# Altium project PCB_Project_bjt.PrjPcb
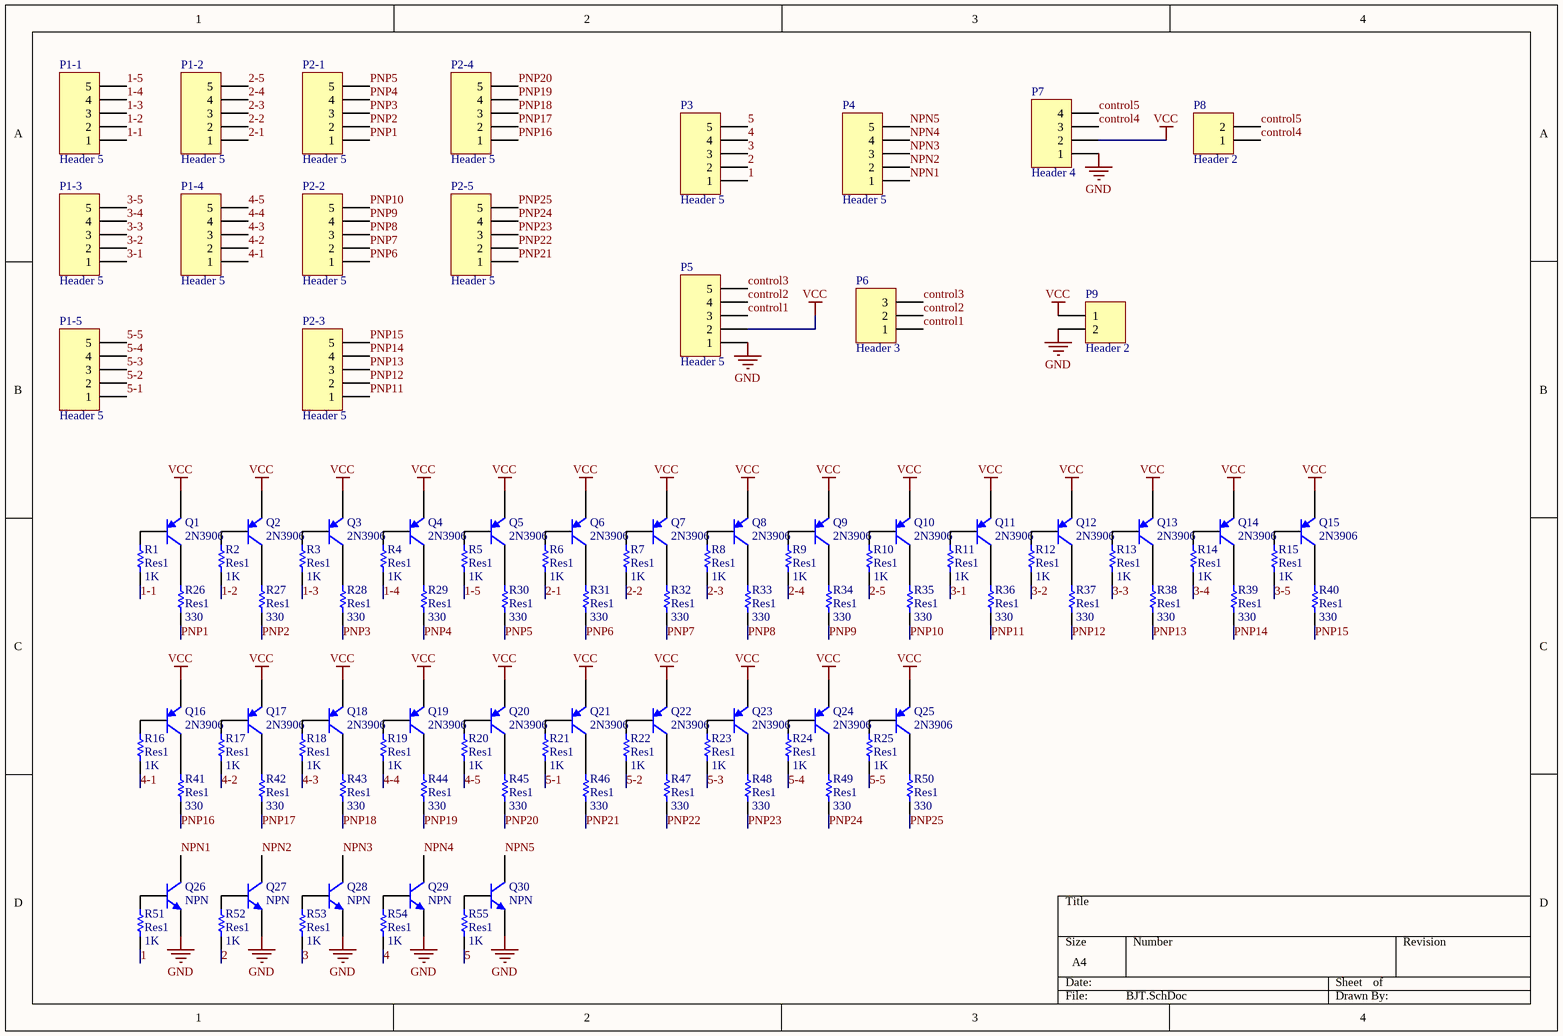
[diagram p0: BJT.SchDoc]
1 sheet, 102 parts. Net scope: global (net labels, ports and power ports of the same name join across sheets).
Board file: PCB1.PcbDoc

## Sheet BJT.SchDoc
size A4; SheetNumber: 1; SheetTotal: 1; SPICEModelCacheCIMVWHFW: <root> / <DocumentId>CIMVWHFW</DocumentId> / <CacheFrame Number="0"> / <Model Name="2n3906" Kind="MDL"> / <Text>*2N3906 / *Si 310mW  40V 200mA 250MHz pkg:TO-92B 1,2,3 / .MODEL 2N3906 PNP(IS=4E-14 BF=400 VAF=50 IKF=0.02 ISE=7E-15 NE=1.16 / + BR=7.5 RC=2.4 CJE=6.3E-12 VJE=0.75 TF=5E-10 CJC=5.8E-12 VJC=0.75 TR=2.3E-8 / + VJS=0.75 XTB=1.5 KF=6E-16 )</Text> / </Model> / <Model Name="npn" Kind="MDL"> / <Text>*Default NPN BJT / *NPN Trans Pinout: C,B,E / .MODEL NPN NPN()</Text> / </Model> / </CacheFrame> / </root>

### Parts
P1-1  Header 5  [HDR1X5]
P1-2  Header 5  [HDR1X5]
P1-3  Header 5  [HDR1X5]
P1-4  Header 5  [HDR1X5]
P1-5  Header 5  [HDR1X5]
P2-1  Header 5  [HDR1X5]
P2-2  Header 5  [HDR1X5]
P2-3  Header 5  [HDR1X5]
P2-4  Header 5  [HDR1X5]
P2-5  Header 5  [HDR1X5]
P3  Header 5  [HDR1X5]
P4  Header 5  [HDR1X5]
P5  Header 5  [HDR1X5]
P6  Header 3  [HDR1X3]
P7  Header 4  [HDR1X4]
P8  Header 2  [HDR1X2]
P9  Header 2  [HDR1X2]
Q1  2N3906  [BJT]
Q2  2N3906  [BJT]
Q3  2N3906  [BJT]
Q4  2N3906  [BJT]
Q5  2N3906  [BJT]
Q6  2N3906  [BJT]
Q7  2N3906  [BJT]
Q8  2N3906  [BJT]
Q9  2N3906  [BJT]
Q10  2N3906  [BJT]
Q11  2N3906  [BJT]
Q12  2N3906  [BJT]
Q13  2N3906  [BJT]
Q14  2N3906  [BJT]
Q15  2N3906  [BJT]
Q16  2N3906  [BJT]
Q17  2N3906  [BJT]
Q18  2N3906  [BJT]
Q19  2N3906  [BJT]
Q20  2N3906  [BJT]
Q21  2N3906  [BJT]
Q22  2N3906  [BJT]
Q23  2N3906  [BJT]
Q24  2N3906  [BJT]
Q25  2N3906  [BJT]
Q26  NPN  [BJT]
Q27  NPN  [BJT]
Q28  NPN  [BJT]
Q29  NPN  [BJT]
Q30  NPN  [BJT]
R1  Res1  value 1K  [AXIAL-0.3]
R2  Res1  value 1K  [AXIAL-0.3]
R3  Res1  value 1K  [AXIAL-0.3]
R4  Res1  value 1K  [AXIAL-0.3]
R5  Res1  value 1K  [AXIAL-0.3]
R6  Res1  value 1K  [AXIAL-0.3]
R7  Res1  value 1K  [AXIAL-0.3]
R8  Res1  value 1K  [AXIAL-0.3]
R9  Res1  value 1K  [AXIAL-0.3]
R10  Res1  value 1K  [AXIAL-0.3]
R11  Res1  value 1K  [AXIAL-0.3]
R12  Res1  value 1K  [AXIAL-0.3]
R13  Res1  value 1K  [AXIAL-0.3]
R14  Res1  value 1K  [AXIAL-0.3]
R15  Res1  value 1K  [AXIAL-0.3]
R16  Res1  value 1K  [AXIAL-0.3]
R17  Res1  value 1K  [AXIAL-0.3]
R18  Res1  value 1K  [AXIAL-0.3]
R19  Res1  value 1K  [AXIAL-0.3]
R20  Res1  value 1K  [AXIAL-0.3]
R21  Res1  value 1K  [AXIAL-0.3]
R22  Res1  value 1K  [AXIAL-0.3]
R23  Res1  value 1K  [AXIAL-0.3]
R24  Res1  value 1K  [AXIAL-0.3]
R25  Res1  value 1K  [AXIAL-0.3]
R26  Res1  value 330  [AXIAL-0.3]
R27  Res1  value 330  [AXIAL-0.3]
R28  Res1  value 330  [AXIAL-0.3]
R29  Res1  value 330  [AXIAL-0.3]
R30  Res1  value 330  [AXIAL-0.3]
R31  Res1  value 330  [AXIAL-0.3]
R32  Res1  value 330  [AXIAL-0.3]
R33  Res1  value 330  [AXIAL-0.3]
R34  Res1  value 330  [AXIAL-0.3]
R35  Res1  value 330  [AXIAL-0.3]
R36  Res1  value 330  [AXIAL-0.3]
R37  Res1  value 330  [AXIAL-0.3]
R38  Res1  value 330  [AXIAL-0.3]
R39  Res1  value 330  [AXIAL-0.3]
R40  Res1  value 330  [AXIAL-0.3]
R41  Res1  value 330  [AXIAL-0.3]
R42  Res1  value 330  [AXIAL-0.3]
R43  Res1  value 330  [AXIAL-0.3]
R44  Res1  value 330  [AXIAL-0.3]
R45  Res1  value 330  [AXIAL-0.3]
R46  Res1  value 330  [AXIAL-0.3]
R47  Res1  value 330  [AXIAL-0.3]
R48  Res1  value 330  [AXIAL-0.3]
R49  Res1  value 330  [AXIAL-0.3]
R50  Res1  value 330  [AXIAL-0.3]
R51  Res1  value 1K  [AXIAL-0.3]
R52  Res1  value 1K  [AXIAL-0.3]
R53  Res1  value 1K  [AXIAL-0.3]
R54  Res1  value 1K  [AXIAL-0.3]
R55  Res1  value 1K  [AXIAL-0.3]

### Nets
GND: P5.1 P7.1 P9.2 Q26.3(E) Q27.3(E) Q28.3(E) Q29.3(E) Q30.3(E)
VCC: P5.2 P7.2 P9.1 Q1.1(E) Q2.1(E) Q3.1(E) Q4.1(E) Q5.1(E) Q6.1(E) Q7.1(E) Q8.1(E) Q9.1(E) Q10.1(E) Q11.1(E) Q12.1(E) Q13.1(E) Q14.1(E) Q15.1(E) Q16.1(E) Q17.1(E) Q18.1(E) Q19.1(E) Q20.1(E) Q21.1(E) Q22.1(E) Q23.1(E) Q24.1(E) Q25.1(E)
1: P3.1 R51.1
1-1: P1-1.1 R1.1
1-2: P1-1.2 R2.1
1-3: P1-1.3 R3.1
1-4: P1-1.4 R4.1
1-5: P1-1.5 R5.1
2: P3.2 R52.1
2-1: P1-2.1 R6.1
2-2: P1-2.2 R7.1
2-3: P1-2.3 R8.1
2-4: P1-2.4 R9.1
2-5: P1-2.5 R10.1
3: P3.3 R53.1
3-1: P1-3.1 R11.1
3-2: P1-3.2 R12.1
3-3: P1-3.3 R13.1
3-4: P1-3.4 R14.1
3-5: P1-3.5 R15.1
4: P3.4 R54.1
4-1: P1-4.1 R16.1
4-2: P1-4.2 R17.1
4-3: P1-4.3 R18.1
4-4: P1-4.4 R19.1
4-5: P1-4.5 R20.1
5: P3.5 R55.1
5-1: P1-5.1 R21.1
5-2: P1-5.2 R22.1
5-3: P1-5.3 R23.1
5-4: P1-5.4 R24.1
5-5: P1-5.5 R25.1
control1: P5.3 P6.1
control2: P5.4 P6.2
control3: P5.5 P6.3
control4: P7.3 P8.1
control5: P7.4 P8.2
NPN1: P4.1 Q26.1(C)
NPN2: P4.2 Q27.1(C)
NPN3: P4.3 Q28.1(C)
NPN4: P4.4 Q29.1(C)
NPN5: P4.5 Q30.1(C)
PNP1: P2-1.1 R26.1
PNP2: P2-1.2 R27.1
PNP3: P2-1.3 R28.1
PNP4: P2-1.4 R29.1
PNP5: P2-1.5 R30.1
PNP6: P2-2.1 R31.1
PNP7: P2-2.2 R32.1
PNP8: P2-2.3 R33.1
PNP9: P2-2.4 R34.1
PNP10: P2-2.5 R35.1
PNP11: P2-3.1 R36.1
PNP12: P2-3.2 R37.1
PNP13: P2-3.3 R38.1
PNP14: P2-3.4 R39.1
PNP15: P2-3.5 R40.1
PNP16: P2-4.1 R41.1
PNP17: P2-4.2 R42.1
PNP18: P2-4.3 R43.1
PNP19: P2-4.4 R44.1
PNP20: P2-4.5 R45.1
PNP21: P2-5.1 R46.1
PNP22: P2-5.2 R47.1
PNP23: P2-5.3 R48.1
PNP24: P2-5.4 R49.1
PNP25: P2-5.5 R50.1
NetQ1_2: Q1.2(B) R1.2
NetQ1_3: Q1.3(C) R26.2
NetQ2_2: Q2.2(B) R2.2
NetQ2_3: Q2.3(C) R27.2
NetQ3_2: Q3.2(B) R3.2
NetQ3_3: Q3.3(C) R28.2
NetQ4_2: Q4.2(B) R4.2
NetQ4_3: Q4.3(C) R29.2
NetQ5_2: Q5.2(B) R5.2
NetQ5_3: Q5.3(C) R30.2
NetQ6_2: Q6.2(B) R6.2
NetQ6_3: Q6.3(C) R31.2
NetQ7_2: Q7.2(B) R7.2
NetQ7_3: Q7.3(C) R32.2
NetQ8_2: Q8.2(B) R8.2
NetQ8_3: Q8.3(C) R33.2
NetQ9_2: Q9.2(B) R9.2
NetQ9_3: Q9.3(C) R34.2
NetQ10_2: Q10.2(B) R10.2
NetQ10_3: Q10.3(C) R35.2
NetQ11_2: Q11.2(B) R11.2
NetQ11_3: Q11.3(C) R36.2
NetQ12_2: Q12.2(B) R12.2
NetQ12_3: Q12.3(C) R37.2
NetQ13_2: Q13.2(B) R13.2
NetQ13_3: Q13.3(C) R38.2
NetQ14_2: Q14.2(B) R14.2
NetQ14_3: Q14.3(C) R39.2
NetQ15_2: Q15.2(B) R15.2
NetQ15_3: Q15.3(C) R40.2
NetQ16_2: Q16.2(B) R16.2
NetQ16_3: Q16.3(C) R41.2
NetQ17_2: Q17.2(B) R17.2
NetQ17_3: Q17.3(C) R42.2
NetQ18_2: Q18.2(B) R18.2
NetQ18_3: Q18.3(C) R43.2
NetQ19_2: Q19.2(B) R19.2
NetQ19_3: Q19.3(C) R44.2
NetQ20_2: Q20.2(B) R20.2
NetQ20_3: Q20.3(C) R45.2
NetQ21_2: Q21.2(B) R21.2
NetQ21_3: Q21.3(C) R46.2
NetQ22_2: Q22.2(B) R22.2
NetQ22_3: Q22.3(C) R47.2
NetQ23_2: Q23.2(B) R23.2
NetQ23_3: Q23.3(C) R48.2
NetQ24_2: Q24.2(B) R24.2
NetQ24_3: Q24.3(C) R49.2
NetQ25_2: Q25.2(B) R25.2
NetQ25_3: Q25.3(C) R50.2
NetQ26_2: Q26.2(B) R51.2
NetQ27_2: Q27.2(B) R52.2
NetQ28_2: Q28.2(B) R53.2
NetQ29_2: Q29.2(B) R54.2
NetQ30_2: Q30.2(B) R55.2

### Library data of the parts
P1-1-P1-5 P2-1-P2-5 P3-P5 = Header 5: Header, 5-Pin; LatestRevisionDate: 17-Jul-2002; LatestRevisionNote: Re-released for DXP Platform.; Publisher: Altium Limited
P6 = Header 3: Header, 3-Pin; LatestRevisionDate: 17-Jul-2002; LatestRevisionNote: Re-released for DXP Platform.; Publisher: Altium Limited
P7 = Header 4: Header, 4-Pin; LatestRevisionDate: 17-Jul-2002; LatestRevisionNote: Re-released for DXP Platform.; Publisher: Altium Limited
P8 P9 = Header 2: Header, 2-Pin; LatestRevisionDate: 17-Jul-2002; LatestRevisionNote: Re-released for DXP Platform.; Publisher: Altium Limited
Q1-Q25 = 2N3906: PNP General Purpose Amplifier; pin to pad: 2>3 3>2; Published: 8-Jun-2000; LatestRevisionDate: 15-Jan-2003; LatestRevisionNote: PCB Footprint 'BCY-W3/D4.7' replaced; DatasheetVersion: 1997; PackageVersion: Sep-1998; PackageReference: TO-92A; Publisher: Altium Limited; PackageDescription: TO, Flat Index; 3 In-Line, Axial Leads; Body Dia. 4.5mm; Leads 0.51 x 0.48 mm (max); ComponentLink1Description: Manufacturer Link; ComponentLink1URL: http://www.fairchildsemi.com/; ComponentLink2Description: Datasheet; ComponentLink2URL: http://www.fairchildsemi.com/ds/2N%2F2N3906.pdf
Q26-Q30 = NPN: NPN Bipolar Transistor; pin to pad: 1>2 2>3 3>1; Published: 8-Jun-2000; LatestRevisionDate: 17-Jul-2002; LatestRevisionNote: Re-released for DXP Platform.; PackageReference: TO-226-AA; Publisher: Altium Limited; PackageDescription: TO, Flat Index; 3 In-Line, Axial Leads; Body Dia. 4.8mm; Leads 0.55 x 0.51 mm (max); Code_JEDEC: TO-226-AA
R1-R55 = Res1: Resistor; Published: 8-Jun-2000; LatestRevisionDate: 17-Jul-2002; LatestRevisionNote: Re-released for DXP Platform.; PackageReference: AXIAL-0.3; Publisher: Altium Limited; PackageDescription: Axial Device, Thru-Hole; 2 Leads; 0.3 in Pin Spacing